# EAGLE schematic arduino (EAGLE 6.1)
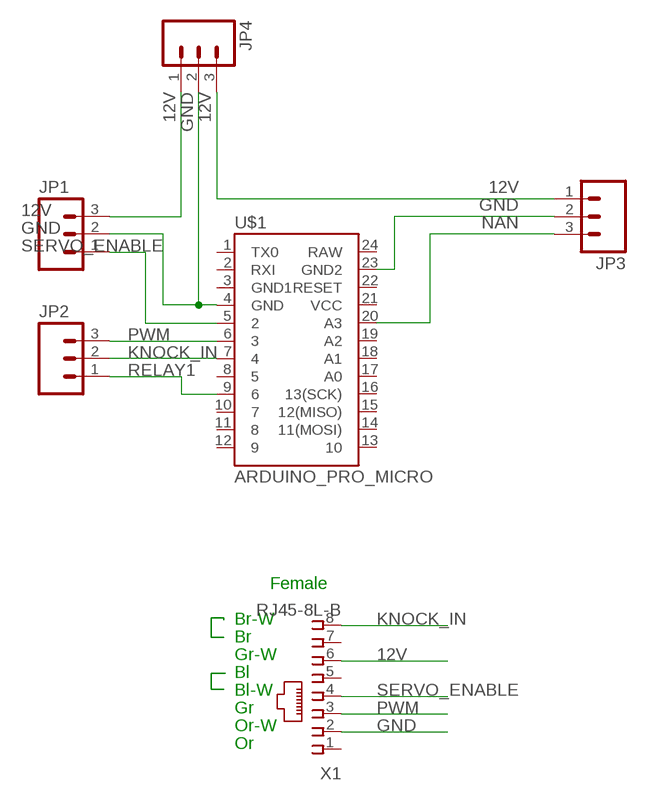
[diagram p0: schematic, sheet 1]

## Parts
JP1  M03  [JST-3-SMD]
JP2  M03  [JST-3-SMD]
JP3  M03  [JST-3-SMD]
JP4  M03  [JST-3-SMD]
U$1  ARDUINO_PRO_MICRO  [ARDUINO_PRO_MICRO]
X1  RJ45-8L-B  [RJ45-NO-SHIELD]

## Nets
12V: JP1.3 JP3.1 JP4.1 JP4.3 X1.6
GND: JP1.2 JP3.2 JP4.2 U$1.4(GND) U$1.23(GND2) X1.2
KNOCK_IN: JP2.2 U$1.7 X1.8
NAN: JP3.3 U$1.20(A3)
PWM: JP2.3 U$1.6 X1.3
RELAY1: JP2.1 U$1.9
SERVO_ENABLE: JP1.1 U$1.5 X1.4
Unconnected: U$1.1(TX0) U$1.2(RXI) U$1.3(GND1) U$1.8 U$1.10 U$1.11 U$1.12 U$1.13 U$1.14(11(MOSI)) U$1.15(12(MISO)) U$1.16(13(SCK)) U$1.17(A0) U$1.18(A1) U$1.19(A2) U$1.21(VCC) U$1.22(RESET) U$1.24(RAW) X1.1 X1.5 X1.7

## Notes on the sheet
- Female
- Br-W
- Br
- Gr-W
- Bl
- Bl-W
- Gr
- Or-W
- Or

## Library data of the parts
JP1-JP4 = SparkFun-Connectors:M03: Header 3 Standard 3-pin 0.1" header. Use with straight break away headers (SKU : PRT-00116), right angle break away headers (PRT-00553), swiss pins (PRT-00743), machine pins (PRT-00117), and female headers (PRT-00115). Molex polarized connector foot print use with SKU : PRT-08232 with associated crimp pins and housings.
U$1 = SparkFun-Boards:ARDUINO_PRO_MICRO
X1 = con-tycoelectronics:RJ45: CORCOM Modular RJ Jacks No Shield Source: www.tycoelectronics.com .. ENG_DS_1654001_1099_RJ_L_0507.pdf; MF: TYCO ELECTRONICS; MPN: RJ45-8L-B; OC_FARNELL: 1279843; OC_NEWARK: 52K4445